# Altium schematic sheet PWM_soldeerbout.SchDoc
size A4; SheetNumber: 4; SheetTotal: 5
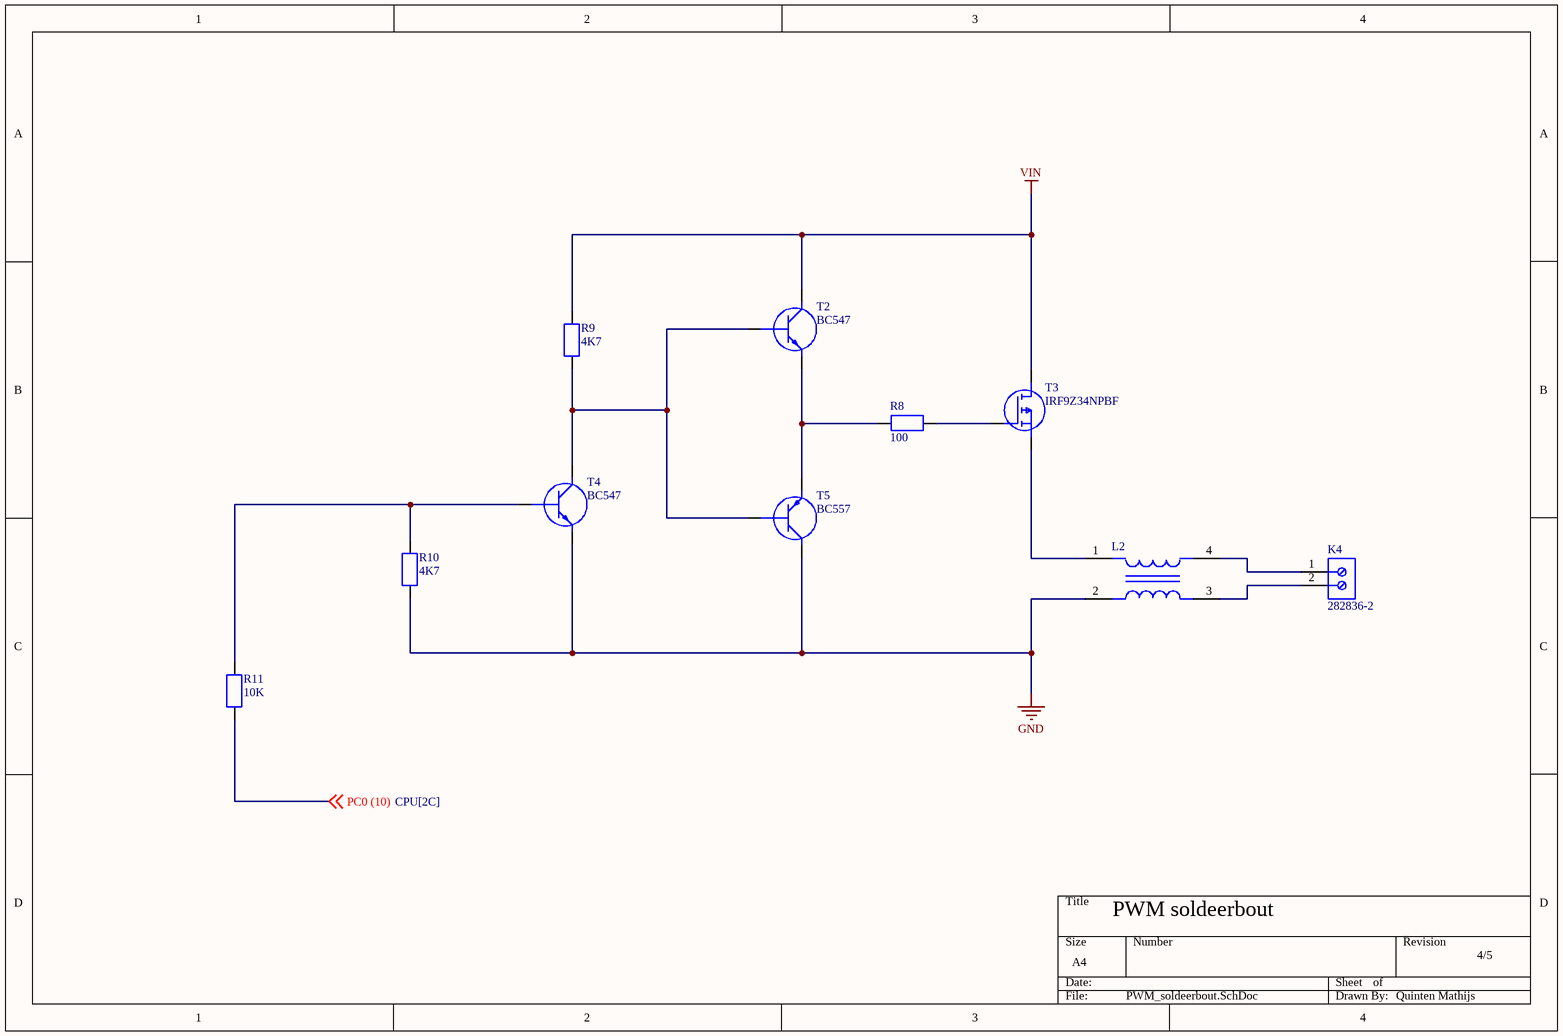
[diagram p0: PWM_soldeerbout.SchDoc]

## Parts
K4  282836-2  [TECO-282836-2_V]
L2  (no value)  [2545]
R8  100  [R_0805_L]
R9  4K7  [R_0805_L]
R10  4K7  [R_0805_L]
R11  10K  [R_0805_L]
T2  BC547  [SOT_23]
T3  IRF9Z34NPBF  [TO_252]
T4  BC547  [SOT_23]
T5  BC557  [SOT_23]

## Nets
GND: L2.2 R10.1 T4.3(E) T5.3(C)
VIN: R9.2 T2.1(C) T3.3(D)
PC0 (10): R11.1 ; off-sheet PC0 (10)
NetK4_1: K4.1 L2.4
NetK4_2: K4.2 L2.3
NetL2_1: L2.1 T3.2(S)
NetR8_1: R8.1 T2.3(E) T5.1(E)
NetR8_2: R8.2 T3.1(G)
NetR9_1: R9.1 T2.2(B) T4.1(C) T5.2(B)
NetR10_2: R10.2 R11.2 T4.2(B)

## Notes on the sheet
- PWM soldeerbout
- 4/5
- Quinten Mathijs

## Library data of the parts
K4 = CMP-1684-00017-1: Female Header, Pitch 5 mm, 1 x 2 Position, Height 10 mm, Tail Length 3.5 mm, Rohs, Bulk; Manufacturer: TE Connectivity; Wire Gauge: 16-30AWG; Product Training Modules: Wire-to-BoardEurostyleTerminalBlocks; Clamp Material - Plating: Brass-NickelPlated; Voltage: 300V; Mating Orientation: HorizontalwithBoard; Current: 13.5A; Pitch: 0.197"(5.00mm); Screw Thread: M3; 3D Model: 282836-2.pdf; Other Names: 5ULV-02B / A98076; Dynamic Catalog: BuchananSeries; Number of Levels: 1; Torque - Screw: 0.68Nm(6Lb-In); Featured Product: EurostyleTerminalBlockConnectors; Positions Per Level: 2; Wire Termination: Screw-RisingCageClamp; Datasheet URL: http://www.te.com.cn/commerce/DocumentDelivery/DDEController?Action=showdoc&DocId=Catalog+Section%7F1308389_EUROSTYLE_TERMINAL_BLOCKS%7F0607%7Fpdf%7FEnglish%7FENG_CS_1308389_EUROSTYLE_TERMINAL_BLOCKS_0607.pdf%7F282836-2; Color: Green; Family: TerminalBlocks-WiretoBoard; RoHS Information: 282836-2StatementofCompliance; Standard Package: 300; Contact Material - Plating: Brass-TinPlated; Manufacturer URL: http://www.te.com; Housing Material: Polyamide(PA66),Nylon6/6; Features: Interlocking(Side); Package Description: Female Header, Pitch 5 mm, 1 x 2 Position, Height 10 mm, Tail Length 3.5 mm; Mounting Type: ThroughHole; Package Reference: THD; Packaging: Bulk; Series: Buchanan; Category: Connectors,Interconnects; Screw Material - Plating: Brass-NickelPlated
L2 = Common_Mode_Choke: Max Current Rating: 2A; Number of Lines: 2; Impedance: 900R; Element Configuration: Dual; Insulation Resistance: 10MR; Test Frequency: 100MHz; DC Resistance (DCR): 60mR; Voltage Rating (DC): 50V; Current Rating: 2.3A; Number of Pins: 4; DC Current: 2A; Mount: Surface Mount; Current: 2A; REACH SVHC: No SVHC; Width: 4.5mm; Case/Package: 1808; Voltage Rating: 50V; Package Quantity: 1; Height: 2mm; Max DC Current: 2A; Packaging: Tape and Reel; Max Operating Temperature: 85°C; Lead Free: Lead Free; Length: 0.185inch; Series: ACM; Radiation Hardening: No; Max Voltage Rating (DC): 50V; Termination: Flat; Depth: 4.7mm; RoHS Compliant: Yes; DC Resistance-Max: 60mR; Min Operating Temperature: -40°C
R8-R11 = 0805 (Resistor): Resistor; Manufacturer: Vishay Dale; Part Number: CRCW08050000Z0EA
T2 T4 = Transistor_NPN: Manufacturer: On Semiconductor; PartNumber: BC547C; IC Continuous (A): 0.1; fT Min (MHz): 150; Packing: Bulk Box; Polarity: NPN; Mounting Technology: Through Hole; ComponentLink1URL: http://www.onsemi.com/; ComponentLink1Description: Manufacturer URL; ComponentLink3URL: http://www.onsemi.cn/pub_link/Collateral/2N6426-D.PDF; DatasheetVersion: Rev. 7; PackageVersion: Rev. AM; RoHS: FALSE; ComponentLink2URL: http://www.onsemi.com/pub_link/Collateral/BC546-D.PDF; ComponentLink3Description: Package Specification; PackageDescription: 3-Pin Transistor Outline, Body 4.825 x 3.685 mm, Pitch 1.27 mm; PackageReference: TO-92-3-29-11_AM_SL; ComponentLink2Description: Datasheet
T3 = MOSFET_P: Manufacturer: Fairchild Semiconductor; Reel Quantity: 3000; Drain Source Voltage Vds: 20V; Power Dissipation Pd: 500mW; On Resistance Rds(on): 52mohm; Full Power Rating Temperature: 25°C; Voltage Vgs Max: -800mV; Pulse Current Idm: 10A; Rds(on) Test Voltage Vgs: -4.5V; External Depth: 2.5mm; Transistor Case Style: SOT-23; No. of Pins: 3; Continuous Drain Current Id: 2.4A; Voltage Vds Typ: -20V; Voltage Vgs th Max: -1.5V; Transistor Polarity: PChannel; Package Version: Rev. 3, 05/2015; External Width: 3.05mm; External Length / Height: 1.12mm; SMD Marking: 304P; SVHC: NoSVHC(19-Dec-2012); Termination Type: SMD; Datasheet URL: https://www.fairchildsemi.com/datasheets/FD/FDN304P.pdf; Tape Width: 8mm; Mounting Technology: SurfaceMount; Voltage Vgs Rds on Measurement: -4.5V; Operating Temperature Range: -55°Cto+150°C; Current Temperature: 25°C; Operating Temperature Min: -55°C; Threshold Voltage Vgs Typ: -800mV; Package / Case: SOT-23; Manufacturer URL: https://www.fairchildsemi.com/; Voltage Vds: 20V; Datasheet Version: Rev. C, 01/2001; Operating Temperature Max: 150°C; Package Description: 3-Pin Small Outline Transistor, Body 2.92 x 1.4 mm, Pitch 0.95 mm; Current Id Max: 2.4A; Package URL: https://www.fairchildsemi.com/package-drawings/MA/MA03B.pdf; Package Reference: SSOT3L
T5 = Transistor_PNP: Manufacturer: On Semiconductor; PartNumber: BC557C; Polarity: PNP; IC Continuous (A): -0.1; Packing: Bulk Box; PackageVersion: Rev. AM; RoHS: FALSE; PackageDescription: 3-Pin Transistor Outline, Body 4.825 x 3.685 mm, Pitch 1.27 mm; ComponentLink2Description: Datasheet; DatasheetVersion: Rev. 3; ComponentLink3Description: Package Specification; Mounting Technology: Through Hole; ComponentLink2URL: http://www.onsemi.com/pub_link/Collateral/BC556B-D.PDF; ComponentLink1URL: http://www.onsemi.com/; ComponentLink1Description: Manufacturer URL; ComponentLink3URL: http://www.onsemi.cn/pub_link/Collateral/2N6426-D.PDF; PackageReference: TO-92-3-29-11_AM_SL